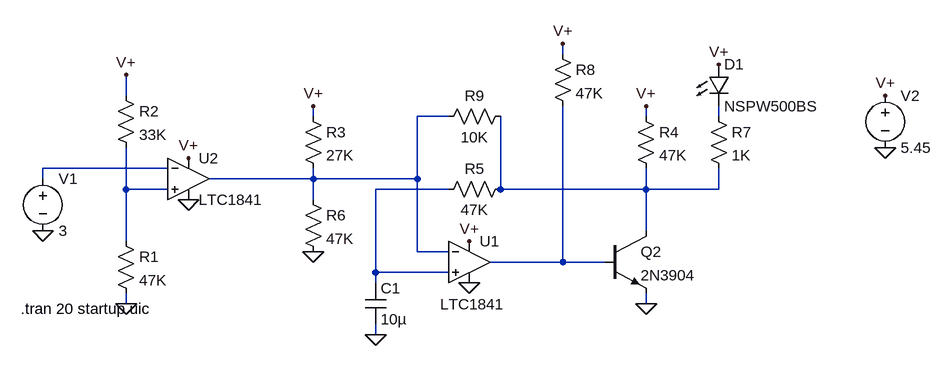
[diagram p0: schematic battery_indicator.asc]
battery_indicator.asc, the LTspice schematic file:
Version 4
SHEET 1 976 680
WIRE 400 -160 400 -176
WIRE -272 -96 -272 -128
WIRE 16 -64 16 -80
WIRE 224 -64 176 -64
WIRE 528 -64 528 -80
WIRE 640 -64 640 -80
WIRE -208 16 -400 16
WIRE -400 32 -400 16
WIRE 16 32 16 16
WIRE 16 32 -144 32
WIRE 176 32 176 -64
WIRE 176 32 16 32
WIRE -272 48 -272 -16
WIRE -208 48 -272 48
WIRE 224 48 112 48
WIRE 304 48 304 -64
WIRE 528 48 528 16
WIRE 528 48 304 48
WIRE 640 48 640 16
WIRE 640 48 528 48
WIRE 16 64 16 32
WIRE 528 112 528 48
WIRE -272 128 -272 48
WIRE 176 144 176 32
WIRE 224 144 176 144
WIRE 400 160 400 -80
WIRE 400 160 288 160
WIRE 464 160 400 160
WIRE 112 176 112 48
WIRE 224 176 112 176
WIRE 112 192 112 176
WIRE -272 224 -272 208
WIRE 528 224 528 208
WIRE 112 272 112 256
FLAG 896 -96 V+
FLAG 256 128 V+
FLAG -176 0 V+
FLAG -176 64 0
FLAG 256 192 0
FLAG 896 -16 0
FLAG -400 112 0
FLAG -272 224 0
FLAG -272 -128 V+
FLAG 16 -80 V+
FLAG 528 -80 V+
FLAG 112 272 0
FLAG 16 144 0
FLAG 528 224 0
FLAG 400 -176 V+
FLAG 640 -144 V+
SYMBOL Comparators\\LTC1841 256 160 R0
WINDOW 3 -45 65 Left 2
SYMATTR InstName U1
SYMBOL Comparators\\LTC1841 -176 32 R0
SYMATTR InstName U2
SYMBOL voltage -400 16 R0
WINDOW 123 0 0 Left 0
WINDOW 39 0 0 Left 0
SYMATTR InstName V1
SYMATTR Value 3
SYMBOL voltage 896 -112 R0
WINDOW 123 0 0 Left 0
WINDOW 39 0 0 Left 0
SYMATTR InstName V2
SYMATTR Value 5.45
SYMBOL res -288 112 R0
SYMATTR InstName R1
SYMATTR Value 47K
SYMBOL res -288 -112 R0
SYMATTR InstName R2
SYMATTR Value 33K
SYMBOL res 0 -80 R0
SYMATTR InstName R3
SYMATTR Value 27K
SYMBOL res 512 -80 R0
SYMATTR InstName R4
SYMATTR Value 47K
SYMBOL cap 96 192 R0
SYMATTR InstName C1
SYMATTR Value 10µ
SYMBOL res 320 32 R90
WINDOW 0 0 56 VBottom 2
WINDOW 3 32 56 VTop 2
SYMATTR InstName R5
SYMATTR Value 47K
SYMBOL res 0 48 R0
SYMATTR InstName R6
SYMATTR Value 47K
SYMBOL res 384 -176 R0
SYMATTR InstName R8
SYMATTR Value 47K
SYMBOL res 320 -80 R90
WINDOW 0 0 56 VBottom 2
WINDOW 3 32 56 VTop 2
SYMATTR InstName R9
SYMATTR Value 10K
SYMBOL npn 464 112 R0
SYMATTR InstName Q2
SYMATTR Value 2N3904
SYMBOL LED 624 -144 R0
SYMATTR InstName D1
SYMATTR Value NSPW500BS
SYMATTR Description Diode
SYMATTR Type diode
SYMBOL res 624 -80 R0
SYMATTR InstName R7
SYMATTR Value 1K
TEXT -434 232 Left 2 !.tran 20 startup uic

The netlist it stands for:
* battery_indicator.asc
* U1: LTC1841 (symbol Comparators\LTC1841 not available, pins judged from their places): In+=N005 In-=N001 V+=V+ V-=0 OUT=N007
* U2: LTC1841 (symbol Comparators\LTC1841 not available, pins judged from their places): In+=N004 In-=N003 V+=V+ V-=0 OUT=N001
V1 N003 0 3
V2 V+ 0 5.45
R1 N004 0 47K
R2 V+ N004 33K
R3 V+ N001 27K
R4 V+ N006 47K
C1 N005 0 10µ
R5 N006 N005 47K
R6 N001 0 47K
R8 V+ N007 47K
R9 N006 N001 10K
Q2 N006 N007 0 0 2N3904
D1 V+ N002 NSPW500BS
R7 N002 N006 1K
.model D D
.lib standard.dio
.model NPN NPN
.model PNP PNP
.lib standard.bjt
.tran 20 startup uic
.backanno
.end